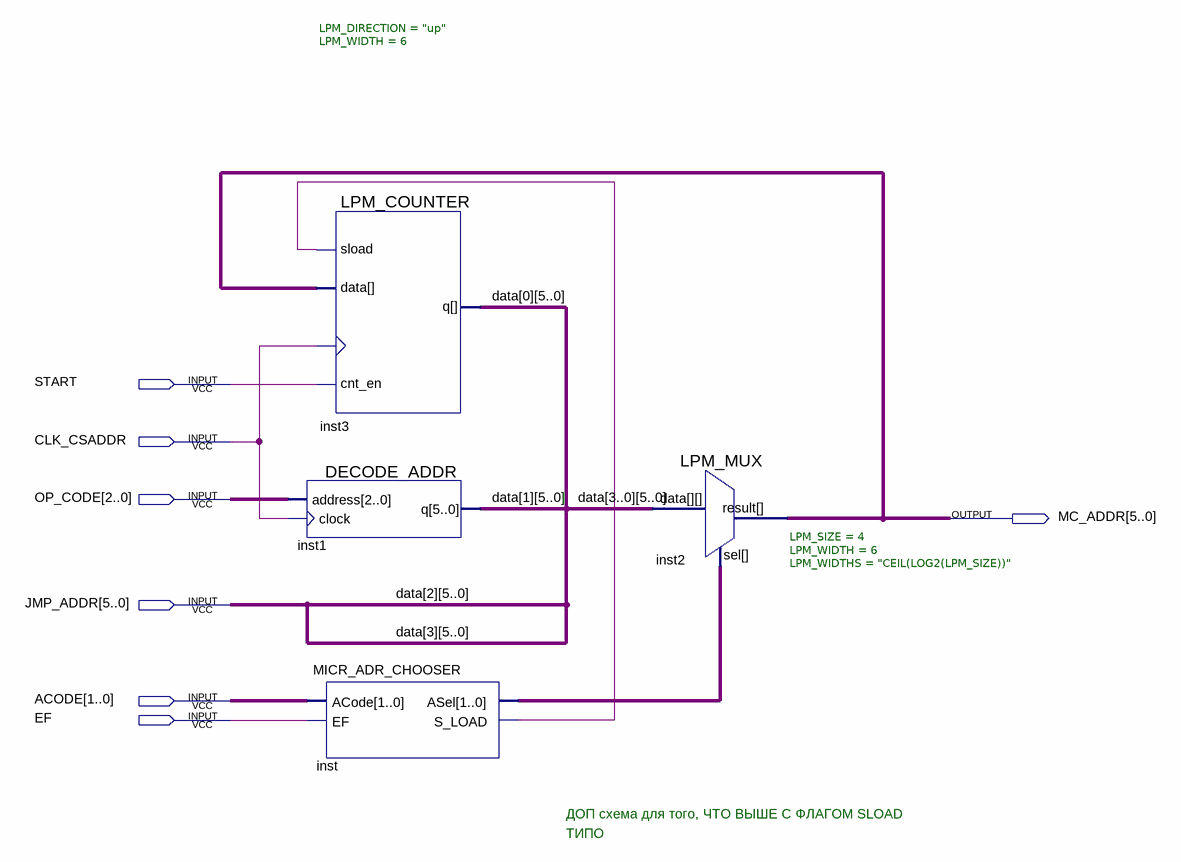
[diagram p0: schematic sheet]
// Quartus schematic MICR_ADDR.bdf as structural Verilog: 4 symbols, 7 pins
module MICR_ADDR (
  input  START,
  input  CLK_CSADDR,
  input  [2:0] OP_CODE,
  input  [5:0] JMP_ADDR,
  input  [1:0] ACODE,
  input  EF,
  output [5:0] MC_ADDR
);

  wire inst_s_load;
  wire [1:0] inst_asel;
  wire [5:0] data_0, data_1;

  DECODE_ADDR inst1 (.address(OP_CODE), .clock(CLK_CSADDR), .q(data_1));
  LPM_COUNTER #(.LPM_DIRECTION("up"), .LPM_WIDTH(6)) inst3 (
    .sload(inst_s_load), .data(MC_ADDR), .clock(CLK_CSADDR), .cnt_en(START), .q(data_0));
  MICR_ADR_CHOOSER inst (.ACode(ACODE), .EF(EF), .ASel(inst_asel), .S_LOAD(inst_s_load));
  LPM_MUX #(.LPM_SIZE(4), .LPM_WIDTH(6), .LPM_WIDTHS("CEIL(LOG2(LPM_SIZE))")) inst2 (
    .data({JMP_ADDR, JMP_ADDR, data_1, data_0}), .sel(inst_asel), .result(MC_ADDR));

  // Other names for the same wires on the sheet: data_2[5:0] = JMP_ADDR; data_3[5:0] = JMP_ADDR

  // Notes on the sheet:
  //   ДОП схема для того, ЧТО ВЫШЕ С ФЛАГОМ SLOAD
  //   ТИПО
endmodule
